# Altium schematic sheet 汇总.SchDoc
size A3
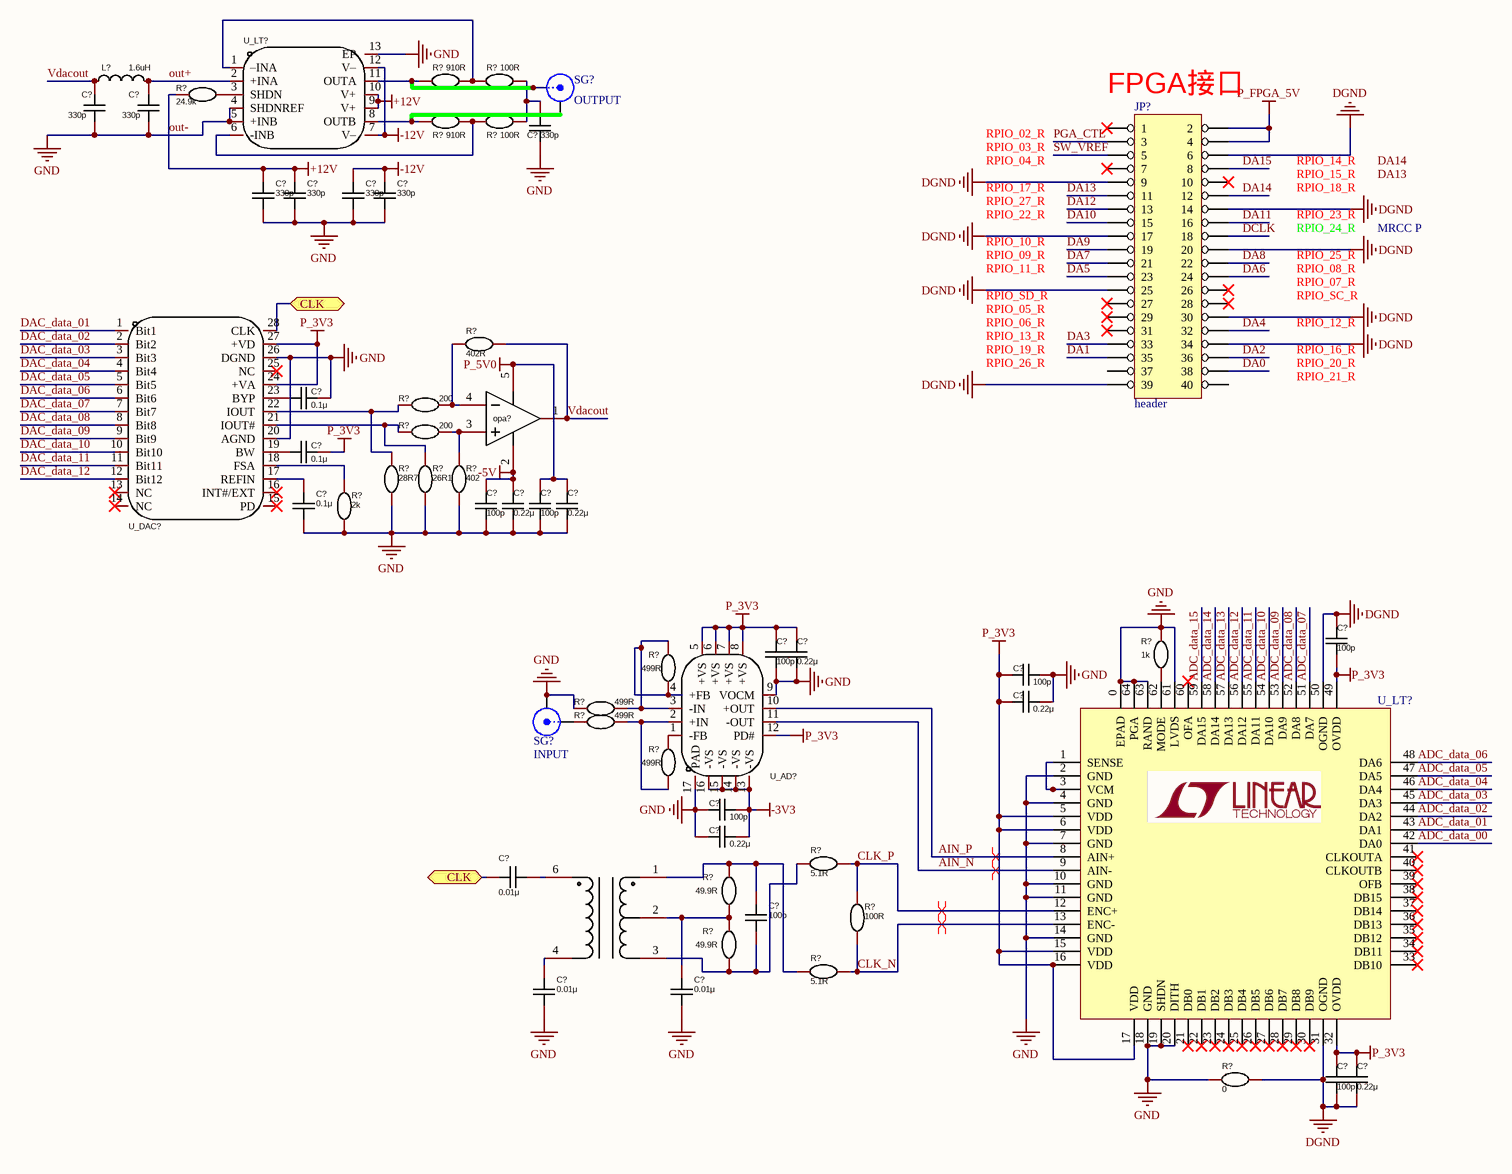
[diagram p0: 汇总.SchDoc]

## Parts
(Parts that share a designator on the sheet are numbered #1, #2 ... from top to bottom, then left to right.)
C?#1  Name: 330p  [C0603]  (hidden comment: GQM1875C2E150GB12D)
C?#2  Name: 330p  [C0603]  (hidden comment: GQM1875C2E150GB12D)
C?#3  Name: 330p  [C0603]  (hidden comment: GQM1875C2E150GB12D)
C?#4  Name: 330p  [C0603]  (hidden comment: GQM1875C2E150GB12D)
C?#5  Name: 330p  [C0603]  (hidden comment: GQM1875C2E150GB12D)
C?#6  Name: 330p  [C0603]  (hidden comment: GQM1875C2E150GB12D)
C?#7  Name: 330p  [C0603]  (hidden comment: GQM1875C2E150GB12D)
C?#8  Name: 0.1μ  [C0603]  (hidden comment: GQM1875C2E150GB12D)
C?#9  Name: 0.1μ  [C0603]  (hidden comment: GQM1875C2E150GB12D)
C?#10  Name: 0.1μ  [C0603]  (hidden comment: GQM1875C2E150GB12D)
C?#11  Name: 100p  [C0603]  (hidden comment: GQM1875C2E150GB12D)
C?#12  Name: 0.22μ  [C0603]  (hidden comment: GQM1875C2E150GB12D)
C?#13  Name: 100p  [C0603]  (hidden comment: GQM1875C2E150GB12D)
C?#14  Name: 0.22μ  [C0603]  (hidden comment: GQM1875C2E150GB12D)
C?#15  Name: 100p  [C0603]  (hidden comment: GQM1875C2E150GB12D)
C?#16  Name: 100p  [C0603]  (hidden comment: GQM1875C2E150GB12D)
C?#17  Name: 0.22μ  [C0603]  (hidden comment: GQM1875C2E150GB12D)
C?#18  Name: 100p  [C0603]  (hidden comment: GQM1875C2E150GB12D)
C?#19  Name: 0.22μ  [C0603]  (hidden comment: GQM1875C2E150GB12D)
C?#20  Name: 100p  [C0603]  (hidden comment: GQM1875C2E150GB12D)
C?#21  Name: 0.22μ  [C0603]  (hidden comment: GQM1875C2E150GB12D)
C?#22  Name: 0.01μ  [C0603]  (hidden comment: GQM1875C2E150GB12D)
C?#23  Name: 100p  [C0603]  (hidden comment: GQM1875C2E150GB12D)
C?#24  Name: 0.01μ  [C0603]  (hidden comment: GQM1875C2E150GB12D)
C?#25  Name: 0.01μ  [C0603]  (hidden comment: GQM1875C2E150GB12D)
C?#26  Name: 100p  [C0603]  (hidden comment: GQM1875C2E150GB12D)
C?#27  Name: 0.22μ  [C0603]  (hidden comment: GQM1875C2E150GB12D)
JP?  header  [header2X20]
L?  Name: 1.6uH  [L0603]  (hidden comment: BRC1608TR20M)
opa?  TLV333IDBVR  [SOT-23-5_L2.9-W1.6-P0.95-LS2.8-BL]  (value not drawn)
R?#1  Name: 910R  [R0603]  (hidden comment: ERA3VEB1001V)
R?#2  Name: 100R  [R0603]  (hidden comment: ERA3VEB1001V)
R?#3  Name: 24.9k  [R0603]  (hidden comment: ERA3VEB1001V)
R?#4  Name: 910R  [R0603]  (hidden comment: ERA3VEB1001V)
R?#5  Name: 100R  [R0603]  (hidden comment: ERA3VEB1001V)
R?#6  Name: 402R  [R0603]  (hidden comment: ERA3VEB1001V)
R?#7  Name: 200  [R0603]  (hidden comment: ERA3VEB1001V)
R?#8  Name: 200  [R0603]  (hidden comment: ERA3VEB1001V)
R?#9  Name: 28R7  [R0603]  (hidden comment: ERA3VEB1001V)
R?#10  Name: 26R1  [R0603]  (hidden comment: ERA3VEB1001V)
R?#11  Name: 402  [R0603]  (hidden comment: ERA3VEB1001V)
R?#12  Name: 2k  [R0603]  (hidden comment: ERA3VEB1001V)
R?#13  Name: 1k  [R0603]  (hidden comment: ERA3VEB1001V)
R?#14  Name: 499R  [R0603]  (hidden comment: ERA3VEB1001V)
R?#15  Name: 499R  [R0603]  (hidden comment: ERA3VEB1001V)
R?#16  Name: 499R  [R0603]  (hidden comment: ERA3VEB1001V)
R?#17  Name: 499R  [R0603]  (hidden comment: ERA3VEB1001V)
R?#18  Name: 5.1R  [R0603]  (hidden comment: ERA3VEB1001V)
R?#19  Name: 49.9R  [R0603]  (hidden comment: ERA3VEB1001V)
R?#20  Name: 100R  [R0603]  (hidden comment: ERA3VEB1001V)
R?#21  Name: 49.9R  [R0603]  (hidden comment: ERA3VEB1001V)
R?#22  Name: 5.1R  [R0603]  (hidden comment: ERA3VEB1001V)
R?#23  Name: 0  [R0603]  (hidden comment: ERA3VEB1001V)
SG?#1  OUTPUT  [SMA-2]
SG?#2  INPUT  [SMA-2]
U?  TC1-1T+  [XFMR-SMD_TC1-1TX]  (value not drawn)
U_AD?  ADA4932-1YCPZ-RL  [LFCSP-16_L3.0-W3.0-P0.50-BL-EP1.3]  (value not drawn)
U_DAC?  DAC902E  [TSSOP-28_L9.7-W4.4-P0.65-LS6.4-BL]  (value not drawn)
U_LT?#1  LT1739CUE#PBF  [DFN-12_L4.0-W3.0-P0.50-BL-EP]  (value not drawn)
U_LT?#2  LTC2208  [QFN64]  (value not drawn)

## Ports
CLK

## Nets
-3V3: C?#20.1 C?#21.1 U_AD?.13(-VS) U_AD?.14(-VS) U_AD?.15(-VS) U_AD?.16(-VS)
-5V: C?#11.1 C?#12.1 opa?.2(V-)
-12V: C?#6.2 C?#7.2 U_LT?#1.7(V–) U_LT?#1.12(V–)
DGND: C?#15.1 C?#26.2 C?#27.2 JP?.6 JP?.9 JP?.14 JP?.17 JP?.20 JP?.25 JP?.30 JP?.34 JP?.39 R?#23.1 U_LT?#2.31(OGND) U_LT?#2.50(OGND)
out-: C?#1.2 C?#2.2 C?#3.2 C?#4.1 C?#4.2 C?#5.1 C?#5.2 C?#6.1 C?#7.1 C?#8.1 C?#10.2 C?#11.2 C?#12.2 C?#13.2 C?#14.2 C?#16.1 C?#17.1 C?#18.1 C?#19.1 C?#20.2 C?#21.2 C?#24.2 C?#25.2 R?#3.1 R?#9.2 R?#10.1 R?#11.1 R?#12.2 R?#13.2 R?#15.2 R?#23.2 SG?#2.1(Y) U_AD?.9(VOCM) U_AD?.17(PAD) U_DAC?.20(AGND) U_DAC?.26(DGND) U_LT?#1.4(SHDNREF) U_LT?#1.5(+INB) U_LT?#1.9(V+) U_LT?#1.10(V+) U_LT?#1.13(EP) U_LT?#2.0(EPAD) U_LT?#2.2(GND) U_LT?#2.4(GND) U_LT?#2.7(GND) U_LT?#2.10(GND) U_LT?#2.11(GND) U_LT?#2.14(GND) U_LT?#2.18(GND) U_LT?#2.19(SHDN) U_LT?#2.20(DITH) U_LT?#2.61(LVDS) U_LT?#2.63(RAND) U_LT?#2.64(PGA)  [also labelled +12V, GND]
P_3V3: C?#9.1 C?#15.2 C?#16.2 C?#17.2 C?#18.2 C?#19.2 C?#26.1 C?#27.1 U_AD?.5(+VS) U_AD?.6(+VS) U_AD?.7(+VS) U_AD?.8(+VS) U_AD?.12(PD#) U_DAC?.24(+VA) U_DAC?.27(+VD) U_LT?#2.5(VDD) U_LT?#2.6(VDD) U_LT?#2.15(VDD) U_LT?#2.16(VDD) U_LT?#2.17(VDD) U_LT?#2.32(OVDD) U_LT?#2.49(OVDD)
P_5V0: C?#13.1 C?#14.1 opa?.5(V+)
P_FPGA_5V: JP?.2 JP?.4
ADC_data_00: U_LT?#2.42(DA0)
ADC_data_01: U_LT?#2.43(DA1)
ADC_data_02: U_LT?#2.44(DA2)
ADC_data_03: U_LT?#2.45(DA3)
ADC_data_04: U_LT?#2.46(DA4)
ADC_data_05: U_LT?#2.47(DA5)
ADC_data_06: U_LT?#2.48(DA6)
ADC_data_07: U_LT?#2.51(DA7)
ADC_data_08: U_LT?#2.52(DA8)
ADC_data_09: U_LT?#2.53(DA9)
ADC_data_10: U_LT?#2.54(DA10)
ADC_data_11: U_LT?#2.55(DA11)
ADC_data_12: U_LT?#2.56(DA12)
ADC_data_13: U_LT?#2.57(DA13)
ADC_data_14: U_LT?#2.58(DA14)
ADC_data_15: U_LT?#2.59(DA15)
AIN_N: U_AD?.11(-OUT) U_LT?#2.9(AIN-)
AIN_P: U_AD?.10(+OUT) U_LT?#2.8(AIN+)
CLK: C?#22.2 U_DAC?.28(CLK) ; port CLK
CLK_N: R?#20.2 R?#22.2 U_LT?#2.13(ENC-)
CLK_P: R?#18.2 R?#20.1 U_LT?#2.12(ENC+)
DA0: JP?.38
DA1: JP?.35
DA2: JP?.36
DA3: JP?.33
DA4: JP?.32
DA5: JP?.23
DA6: JP?.24
DA7: JP?.21
DA8: JP?.22
DA9: JP?.19
DA10: JP?.15
DA11: JP?.16
DA12: JP?.13
DA13: JP?.11
DA14: JP?.12
DA15: JP?.8
DAC_data_01: U_DAC?.1(Bit1)
DAC_data_02: U_DAC?.2(Bit2)
DAC_data_03: U_DAC?.3(Bit3)
DAC_data_04: U_DAC?.4(Bit4)
DAC_data_05: U_DAC?.5(Bit5)
DAC_data_06: U_DAC?.6(Bit6)
DAC_data_07: U_DAC?.7(Bit7)
DAC_data_08: U_DAC?.8(Bit8)
DAC_data_09: U_DAC?.9(Bit9)
DAC_data_10: U_DAC?.10(Bit10)
DAC_data_11: U_DAC?.11(Bit11)
DAC_data_12: U_DAC?.12(Bit12)
DCLK: JP?.18
out+: C?#2.1 L?.2 U_LT?#1.2(+INA)
PGA_CTL: JP?.3
SW_VREF: JP?.5
Vdacout: C?#1.1 L?.1 opa?.1(OUT) R?#6.1
NetC?#3_1: C?#3.1 R?#2.2 R?#5.1
NetC?#8_2: C?#8.2 U_DAC?.23(BYP)
NetC?#9_2: C?#9.2 U_DAC?.19(BW)
NetC?#10_1: C?#10.1 U_DAC?.17(REFIN)
NetC?#22_1: C?#22.1 U?.6
NetC?#23_1: C?#23.1 R?#19.1 R?#22.1 U?.1
NetC?#23_2: C?#23.2 R?#18.1 R?#21.2 U?.3
NetC?#24_1: C?#24.1 U?.4
NetC?#25_1: C?#25.1 R?#19.2 R?#21.1 U?.2
Netopa?_3: opa?.3(IN+) R?#8.2 R?#11.2
Netopa?_4: opa?.4(IN-) R?#6.2 R?#7.2
NetR?#1_1: R?#1.1 SG?#1.2(X) U_LT?#1.11(OUTA)
NetR?#1_2: R?#1.2 R?#2.1 U_LT?#1.1(–INA)
NetR?#3_2: R?#3.2 U_LT?#1.3(SHDN)
NetR?#4_1: R?#4.1 SG?#1.1(Y) U_LT?#1.8(OUTB)
NetR?#4_2: R?#4.2 R?#5.2 U_LT?#1.6(-INB)
NetR?#7_1: R?#7.1 R?#9.1 U_DAC?.22(IOUT)
NetR?#8_1: R?#8.1 R?#10.2 U_DAC?.21(IOUT#)
NetR?#12_1: R?#12.1 U_DAC?.18(FSA)
NetR?#13_1: R?#13.1 U_LT?#2.62(MODE)
NetR?#14_1: R?#14.1 R?#14.2 R?#15.1 U_AD?.3(-IN) U_AD?.4(+FB)
NetR?#16_1: R?#16.1 R?#17.2 U_AD?.2(+IN)
NetR?#16_2: R?#16.2 SG?#2.2(X)
NetR?#17_1: R?#17.1 U_AD?.1(-FB)
NetU_LT?#2_1: U_LT?#2.1(SENSE) U_LT?#2.3(VCM)

Not connected (* = marked no-connect by the designer): JP? 1* 7* 10* 26* 27* 28* 29* 31* 37 40; U_DAC? 13(NC)* 14(NC)* 15(PD)* 16(INT#/EXT)* 25(NC)*; U_LT?#2 21(DB0)* 22(DB1)* 23(DB2)* 24(DB3)* 25(DB4)* 26(DB5)* 27(DB6)* 28(DB7)* 29(DB8)* 30(DB9)* 33(DB10)* 34(DB11)* 35(DB12)* 36(DB13)* 37(DB14)* 38(DB15)* 39(OFB)* 40(CLKOUTB)* 41(CLKOUTA)* 60(OFA)*

## Layout directives
differential pair: AIN_N, AIN_P, CLK_N, CLK_P

## Notes on the sheet
- RPIO_02_R
- (near JP?) FPGA接口
- RPIO_03_R
- RPIO_04_R
- RPIO_17_R
- RPIO_27_R
- RPIO_14_R
- RPIO_15_R
- RPIO_18_R
- RPIO_22_R
- RPIO_10_R
- RPIO_09_R
- RPIO_11_R
- RPIO_23_R
- RPIO_24_R
- RPIO_25_R
- RPIO_08_R
- MRCC P
- RPIO_SD_R
- RPIO_05_R
- RPIO_06_R
- RPIO_13_R
- RPIO_07_R
- RPIO_SC_R
- RPIO_12_R
- RPIO_19_R
- RPIO_26_R
- RPIO_16_R
- RPIO_20_R
- RPIO_21_R
- Labels drawn without touching a wire or pin: DA13, DA14

## Library data of the parts
C?#1-C?#27 = GQM1875C2E150GB12D: Manufacturer: muRata(村田); Add into BOM: yes; Value: 15pF; Tolerance: ±2%; Voltage Rated: 250V; Temperature Coefficient: C0G; Symbol: GQM1875C2E150GB12D; Device: GQM1875C2E150GB12D; LCSC Part Name: 15pF ±2% 250V; Supplier Part: C464956; Manufacturer Part: GQM1875C2E150GB12D; Supplier Footprint: 0603; JLCPCB Part Class: Extended Part; Datasheet: https://atta.szlcsc.com/upload/public/pdf/source/20191129/C464956_729E33C855F5153A82A781C5936E0B19.pdf; Supplier: LCSC; Convert to PCB: yes
JP? = HEADER 20X2
L? = BRC1608TR20M: Manufacturer: TAIYO YUDEN(太诱); Add into BOM: yes; Value: 200nH; Tolerance: ±20%; Rated Current: 980mA; DC Resistance (DCR): 60mΩ; Symbol: BRC1608TR20M; Device: BRC1608TR20M; LCSC Part Name: 200nH ±20% 980mA 60mΩ; Supplier Part: C223130; Manufacturer Part: BRC1608TR20M; Supplier Footprint: 0603; JLCPCB Part Class: Extended Part; Datasheet: https://atta.szlcsc.com/upload/public/pdf/source/20190327/C223130_C6CFE9E03676597BD891B5198289E3FD.pdf; Supplier: LCSC; Convert to PCB: yes
opa? = TLV333IDBVR: Manufacturer: TI(德州仪器); Add into BOM: yes; Name: TLV333IDBVR; Symbol: TLV333IDBVR; Device: TLV333IDBVR; LCSC Part Name: TLV333IDBVR; Supplier Part: C473369; Manufacturer Part: TLV333IDBVR; Supplier Footprint: SOT-23-5; JLCPCB Part Class: Extended Part; Datasheet: https://atta.szlcsc.com/upload/public/pdf/source/20191225/C473369_E9C4D9DF171D98081AD79953B6D53604.pdf; Supplier: LCSC; Convert to PCB: yes; Number of Circuits: -
R?#1-R?#23 = ERA3VEB1001V: Manufacturer: PANASONIC(松下); Add into BOM: yes; Temperature Coefficient: ±25ppm/K; Tolerance: ±0.1%; Overload Voltage (Max): 100V; Power(Watts): 125mW; Value: 1kΩ; Symbol: ERA3VEB1001V; Device: ERA3VEB1001V; LCSC Part Name: 1KΩ(1001) ±0.1%; Supplier Part: C490794; Manufacturer Part: ERA3VEB1001V; Supplier Footprint: 0603; JLCPCB Part Class: Extended Part; Datasheet: https://atta.szlcsc.com/upload/public/pdf/source/20200407/C490794_144E786BD6B5906C11E86C00580B1EF5.pdf; Supplier: LCSC; Convert to PCB: yes; Operating Temperature Range: -55℃~+155℃; Type: 薄膜电阻
SG?#1 SG?#2 = SMA_KHD
U? = TC1-1T+: Manufacturer: Mini-Circuits; Add into BOM: yes; Name: TC1-1T+; Symbol: TC1-1T+; Device: TC1-1T+; LCSC Part Name: TC1-1T+; Supplier Part: C879831; Manufacturer Part: TC1-1T+; Supplier Footprint: SMD,3.8x3.8mm; JLCPCB Part Class: Extended Part; Datasheet: https://atta.szlcsc.com/upload/public/pdf/source/20201013/C879831_54F63EAB507C5E12C50BC96C0685F0E3.pdf; Supplier: LCSC; Convert to PCB: yes
U_AD? = ADA4932-1YCPZ-RL: Manufacturer: ADI(亚德诺)/LINEAR(凌特); Add into BOM: yes; Name: ADA4932-1YCPZ-RL; Symbol: ADA4932-1YCPZ-RL; Device: ADA4932-1YCPZ-RL; LCSC Part Name: ADA4932-1YCPZ-RL; Supplier Part: C654329; Manufacturer Part: ADA4932-1YCPZ-RL; Supplier Footprint: LFCSP-16; JLCPCB Part Class: Extended Part; Datasheet: https://atta.szlcsc.com/upload/public/pdf/source/20200309/C494505_BB399B04ACF7E8080BF0845658E50F75.pdf; Supplier: LCSC; Convert to PCB: yes; Number of Circuits: -
U_DAC? = DAC902E: Manufacturer: TI(德州仪器); Add into BOM: yes; Name: DAC902E; Symbol: DAC902E; Device: DAC902E; LCSC Part Name: DAC902E; Supplier Part: C2867226; Manufacturer Part: DAC902E; Supplier Footprint: TSSOP-28; JLCPCB Part Class: Extended Part; Supplier: LCSC; Convert to PCB: yes
U_LT?#1 = LT1739CUE#PBF: Manufacturer: ADI(亚德诺)/LINEAR(凌特); Add into BOM: yes; Name: LT1739CUE#PBF; Symbol: LT1739CUE#PBF; Device: LT1739CUE#PBF; LCSC Part Name: LT1739CUE#PBF; Supplier Part: C655142; Manufacturer Part: LT1739CUE#PBF; Supplier Footprint: DFN-12; JLCPCB Part Class: Extended Part; Datasheet: https://atta.szlcsc.com/upload/public/pdf/source/20220519/FEE0574E27C5E2A7A90F2FEF33F9F15A.pdf; Supplier: LCSC; Convert to PCB: yes